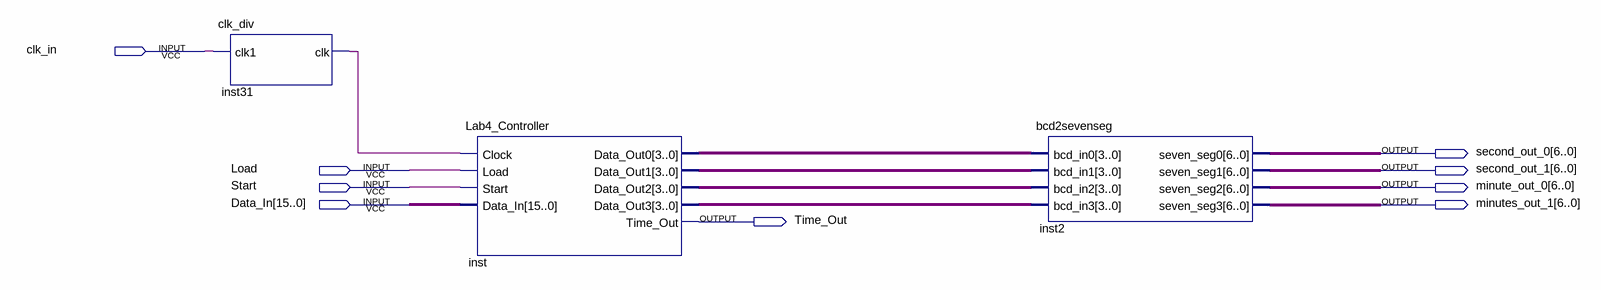
[diagram p0: schematic sheet]
// Quartus schematic Lab4.bdf as structural Verilog: 3 symbols, 9 pins
module Lab4 (
  input  clk_in,
  input  Load,
  input  Start,
  input  [15:0] Data_In,
  output [6:0] second_out_0,
  output [6:0] second_out_1,
  output [6:0] minute_out_0,
  output [6:0] minutes_out_1,
  output Time_Out
);

  wire inst31_clk;
  wire [3:0] inst_data_out0, inst_data_out1, inst_data_out2, inst_data_out3;

  clk_div inst31 (.clk1(clk_in), .clk(inst31_clk));
  Lab4_Controller inst (
    .Clock(inst31_clk), .Load(Load), .Start(Start), .Data_In(Data_In), .Data_Out0(inst_data_out0),
    .Data_Out1(inst_data_out1), .Data_Out2(inst_data_out2), .Data_Out3(inst_data_out3), .Time_Out(Time_Out));
  bcd2sevenseg inst2 (
    .bcd_in0(inst_data_out0), .bcd_in1(inst_data_out1), .bcd_in2(inst_data_out2), .bcd_in3(inst_data_out3),
    .seven_seg0(second_out_0), .seven_seg1(second_out_1), .seven_seg2(minute_out_0),
    .seven_seg3(minutes_out_1));
endmodule
